# Altium schematic sheet HEADERS.SchDoc
size B; Organization: Altium Limited; Address1: L3, 12a Rodborough Rd; Address2: Frenchs Forest; Address3: NSW; Address4: Australia 2086
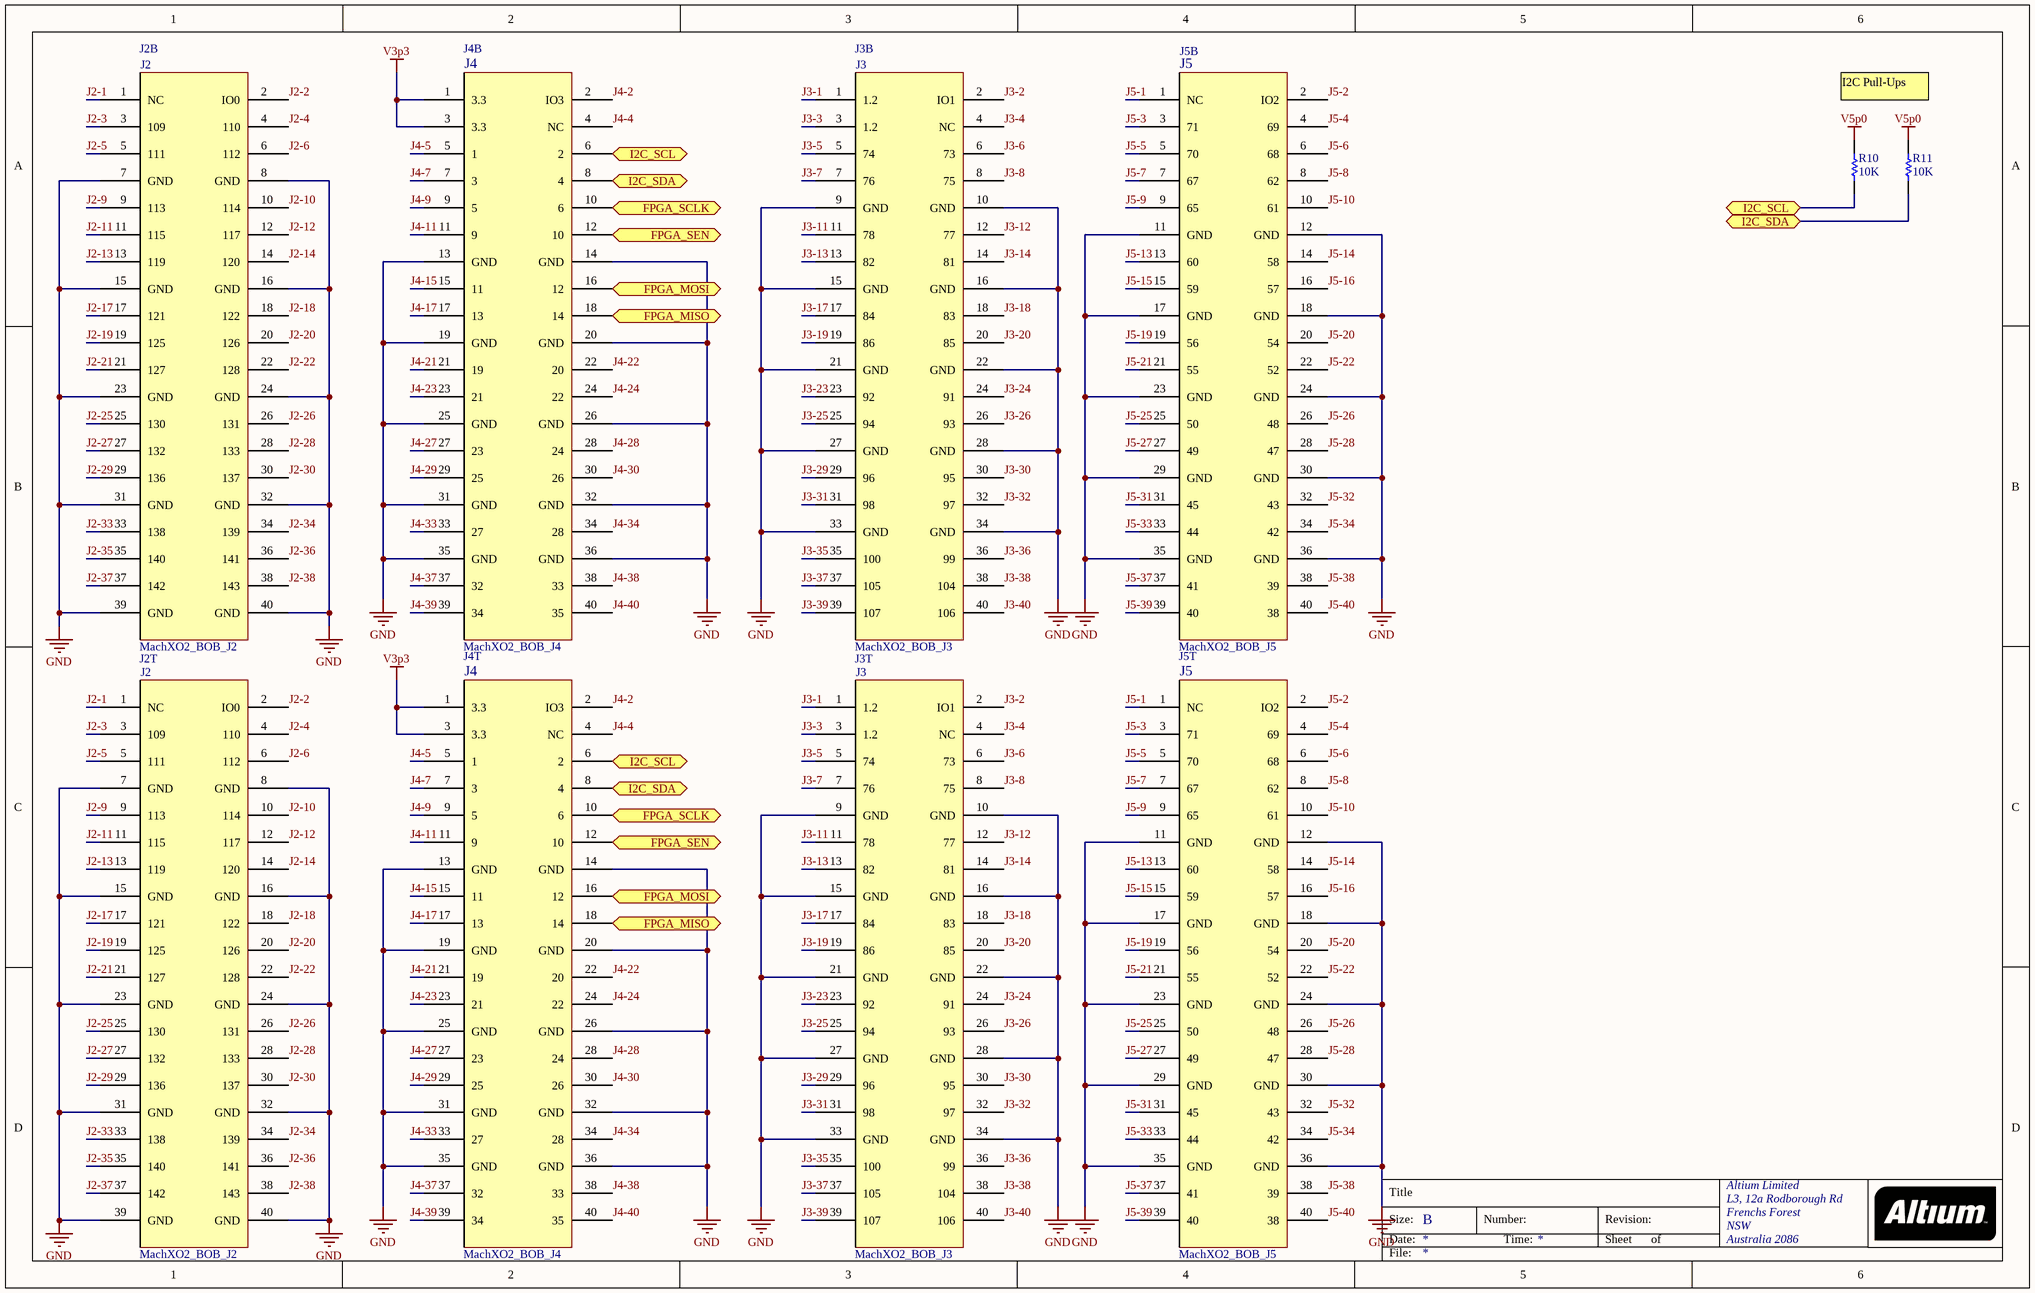
[diagram p0: HEADERS.SchDoc]

## Parts
J2B  MachXO2_BOB_J2  [RECEPTACLE_25.4MM_20x2_P1URC_SMT - duplicate]
J2T  MachXO2_BOB_J2  [HEADER_25.4MM_20x2_SMT_TOP]
J3B  MachXO2_BOB_J3  [RECEPTACLE_25.4MM_20x2_P1URC_SMT - duplicate]
J3T  MachXO2_BOB_J3  [HEADER_25.4MM_20x2_SMT_TOP]
J4B  MachXO2_BOB_J4  [RECEPTACLE_25.4MM_20x2_P1URC_SMT - duplicate]
J4T  MachXO2_BOB_J4  [HEADER_25.4MM_20x2_SMT_TOP]
J5B  MachXO2_BOB_J5  [RECEPTACLE_25.4MM_20x2_P1URC_SMT - duplicate]
J5T  MachXO2_BOB_J5  [HEADER_25.4MM_20x2_SMT_TOP]
R10  10K  [RES, 0603]
R11  10K  [RES, 0603]

## Ports
FPGA_MISO (bidir), FPGA_MOSI, FPGA_SCLK (bidir), FPGA_SEN (bidir), I2C_SCL (bidir), I2C_SDA (bidir)

## Nets
GND: J2B.7(GND) J2B.8(GND) J2B.15(GND) J2B.16(GND) J2B.23(GND) J2B.24(GND) J2B.31(GND) J2B.32(GND) J2B.39(GND) J2B.40(GND) J2T.7(GND) J2T.8(GND) J2T.15(GND) J2T.16(GND) J2T.23(GND) J2T.24(GND) J2T.31(GND) J2T.32(GND) J2T.39(GND) J2T.40(GND) J3B.9(GND) J3B.10(GND) J3B.15(GND) J3B.16(GND) J3B.21(GND) J3B.22(GND) J3B.27(GND) J3B.28(GND) J3B.33(GND) J3B.34(GND) J3T.9(GND) J3T.10(GND) J3T.15(GND) J3T.16(GND) J3T.21(GND) J3T.22(GND) J3T.27(GND) J3T.28(GND) J3T.33(GND) J3T.34(GND) J4B.13(GND) J4B.14(GND) J4B.19(GND) J4B.20(GND) J4B.25(GND) J4B.26(GND) J4B.31(GND) J4B.32(GND) J4B.35(GND) J4B.36(GND) J4T.13(GND) J4T.14(GND) J4T.19(GND) J4T.20(GND) J4T.25(GND) J4T.26(GND) J4T.31(GND) J4T.32(GND) J4T.35(GND) J4T.36(GND) J5B.11(GND) J5B.12(GND) J5B.17(GND) J5B.18(GND) J5B.23(GND) J5B.24(GND) J5B.29(GND) J5B.30(GND) J5B.35(GND) J5B.36(GND) J5T.11(GND) J5T.12(GND) J5T.17(GND) J5T.18(GND) J5T.23(GND) J5T.24(GND) J5T.29(GND) J5T.30(GND) J5T.35(GND) J5T.36(GND)
V3p3: J4B.1(3.3) J4B.3(3.3) J4T.1(3.3) J4T.3(3.3)
V5p0: R10.1 R11.1
FPGA_MISO: J4B.18(14) J4T.18(14) ; port FPGA_MISO
FPGA_MOSI: J4B.16(12) J4T.16(12) ; port FPGA_MOSI
FPGA_SCLK: J4B.10(6) J4T.10(6) ; port FPGA_SCLK
FPGA_SEN: J4B.12(10) J4T.12(10) ; port FPGA_SEN
I2C_SCL: J4B.6(2) J4T.6(2) R10.2 ; port I2C_SCL
I2C_SDA: J4B.8(4) J4T.8(4) R11.2 ; port I2C_SDA
J2-1: J2B.1(NC) J2T.1(NC)
J2-2: J2B.2(IO0) J2T.2(IO0)
J2-3: J2B.3(109) J2T.3(109)
J2-4: J2B.4(110) J2T.4(110)
J2-5: J2B.5(111) J2T.5(111)
J2-6: J2B.6(112) J2T.6(112)
J2-9: J2B.9(113) J2T.9(113)
J2-10: J2B.10(114) J2T.10(114)
J2-11: J2B.11(115) J2T.11(115)
J2-12: J2B.12(117) J2T.12(117)
J2-13: J2B.13(119) J2T.13(119)
J2-14: J2B.14(120) J2T.14(120)
J2-17: J2B.17(121) J2T.17(121)
J2-18: J2B.18(122) J2T.18(122)
J2-19: J2B.19(125) J2T.19(125)
J2-20: J2B.20(126) J2T.20(126)
J2-21: J2B.21(127) J2T.21(127)
J2-22: J2B.22(128) J2T.22(128)
J2-25: J2B.25(130) J2T.25(130)
J2-26: J2B.26(131) J2T.26(131)
J2-27: J2B.27(132) J2T.27(132)
J2-28: J2B.28(133) J2T.28(133)
J2-29: J2B.29(136) J2T.29(136)
J2-30: J2B.30(137) J2T.30(137)
J2-33: J2B.33(138) J2T.33(138)
J2-34: J2B.34(139) J2T.34(139)
J2-35: J2B.35(140) J2T.35(140)
J2-36: J2B.36(141) J2T.36(141)
J2-37: J2B.37(142) J2T.37(142)
J2-38: J2B.38(143) J2T.38(143)
J3-1: J3B.1(1.2) J3T.1(1.2)
J3-2: J3B.2(IO1) J3T.2(IO1)
J3-3: J3B.3(1.2) J3T.3(1.2)
J3-4: J3B.4(NC) J3T.4(NC)
J3-5: J3B.5(74) J3T.5(74)
J3-6: J3B.6(73) J3T.6(73)
J3-7: J3B.7(76) J3T.7(76)
J3-8: J3B.8(75) J3T.8(75)
J3-11: J3B.11(78) J3T.11(78)
J3-12: J3B.12(77) J3T.12(77)
J3-13: J3B.13(82) J3T.13(82)
J3-14: J3B.14(81) J3T.14(81)
J3-17: J3B.17(84) J3T.17(84)
J3-18: J3B.18(83) J3T.18(83)
J3-19: J3B.19(86) J3T.19(86)
J3-20: J3B.20(85) J3T.20(85)
J3-23: J3B.23(92) J3T.23(92)
J3-24: J3B.24(91) J3T.24(91)
J3-25: J3B.25(94) J3T.25(94)
J3-26: J3B.26(93) J3T.26(93)
J3-29: J3B.29(96) J3T.29(96)
J3-30: J3B.30(95) J3T.30(95)
J3-31: J3B.31(98) J3T.31(98)
J3-32: J3B.32(97) J3T.32(97)
J3-35: J3B.35(100) J3T.35(100)
J3-36: J3B.36(99) J3T.36(99)
J3-37: J3B.37(105) J3T.37(105)
J3-38: J3B.38(104) J3T.38(104)
J3-39: J3B.39(107) J3T.39(107)
J3-40: J3B.40(106) J3T.40(106)
J4-2: J4B.2(IO3) J4T.2(IO3)
J4-4: J4B.4(NC) J4T.4(NC)
J4-5: J4B.5(1) J4T.5(1)
J4-7: J4B.7(3) J4T.7(3)
J4-9: J4B.9(5) J4T.9(5)
J4-11: J4B.11(9) J4T.11(9)
J4-15: J4B.15(11) J4T.15(11)
J4-17: J4B.17(13) J4T.17(13)
J4-21: J4B.21(19) J4T.21(19)
J4-22: J4B.22(20) J4T.22(20)
J4-23: J4B.23(21) J4T.23(21)
J4-24: J4B.24(22) J4T.24(22)
J4-27: J4B.27(23) J4T.27(23)
J4-28: J4B.28(24) J4T.28(24)
J4-29: J4B.29(25) J4T.29(25)
J4-30: J4B.30(26) J4T.30(26)
J4-33: J4B.33(27) J4T.33(27)
J4-34: J4B.34(28) J4T.34(28)
J4-37: J4B.37(32) J4T.37(32)
J4-38: J4B.38(33) J4T.38(33)
J4-39: J4B.39(34) J4T.39(34)
J4-40: J4B.40(35) J4T.40(35)
J5-1: J5B.1(NC) J5T.1(NC)
J5-2: J5B.2(IO2) J5T.2(IO2)
J5-3: J5B.3(71) J5T.3(71)
J5-4: J5B.4(69) J5T.4(69)
J5-5: J5B.5(70) J5T.5(70)
J5-6: J5B.6(68) J5T.6(68)
J5-7: J5B.7(67) J5T.7(67)
J5-8: J5B.8(62) J5T.8(62)
J5-9: J5B.9(65) J5T.9(65)
J5-10: J5B.10(61) J5T.10(61)
J5-13: J5B.13(60) J5T.13(60)
J5-14: J5B.14(58) J5T.14(58)
J5-15: J5B.15(59) J5T.15(59)
J5-16: J5B.16(57) J5T.16(57)
J5-19: J5B.19(56) J5T.19(56)
J5-20: J5B.20(54) J5T.20(54)
J5-21: J5B.21(55) J5T.21(55)
J5-22: J5B.22(52) J5T.22(52)
J5-25: J5B.25(50) J5T.25(50)
J5-26: J5B.26(48) J5T.26(48)
J5-27: J5B.27(49) J5T.27(49)
J5-28: J5B.28(47) J5T.28(47)
J5-31: J5B.31(45) J5T.31(45)
J5-32: J5B.32(43) J5T.32(43)
J5-33: J5B.33(44) J5T.33(44)
J5-34: J5B.34(42) J5T.34(42)
J5-37: J5B.37(41) J5T.37(41)
J5-38: J5B.38(39) J5T.38(39)
J5-39: J5B.39(40) J5T.39(40)
J5-40: J5B.40(38) J5T.40(38)

## Notes on the sheet
- I2C Pull-Ups
- Title
- Size:
- Date:
- B
- Number:
- Time:
- Revision:
- Sheet
- of
- File:
- (in symbol MachXO2_BOB_J2) J2
- (in symbol MachXO2_BOB_J3) J3
- (in symbol MachXO2_BOB_J4) J4
- (in symbol MachXO2_BOB_J5) J5

## Library data of the parts
J2B J2T = MachXO2_BOB_J2: Manufacturer: 3M; Manufacturer Part Number: 966240-2000-AR-PR; Connector Type: Receptacle, Pass Through; Number of Positions: 40; Number of Positions Loaded: All; Pitch: 0.100" (2.54mm); Description: CONN SOCKET LO-PRO 40PS GOLD SMD; Packaging: Cut Tape (CT); Contact Type: Female Socket; Number of Rows: 2; Row Spacing: 0.100" (2.54mm); Mounting Type: Surface Mount; Termination: Solder; Fastening Type: -; Features: -; Contact Finish: Gold; Contact Finish Thickness: Flash; Color: Black; ComponentLink1URL: http://multimedia.3m.com/mws/mediawebserver?66666UuZjcFSLXTtNxTElXftEVuQEcuZgVs6EVs6E666666--; ComponentLink1Description: http://multimedia.3m.com/mws/mediawebserver?66666UuZjcFSLXTtNxTElXftEVuQEcuZgVs6EVs6E666666--; Supplier 1: Digi-Key; Supplier Part Number 1: 3M9579CT-ND; RoHS: RoHS Compliant; Category: Connectors, Interconnects; Stock 1: 767; Pricing 1: 1=6.97, 10=6.679, 25=6.0984, 50=5.808, 100=5.5176, 250=4.9368 (USD); Supplier 2: Digi-Key; Supplier Part Number 2: TSM-120-01-L-DV-P-ND
J3B J3T = MachXO2_BOB_J3: Manufacturer: 3M; Manufacturer Part Number: 966240-2000-AR-PR; Connector Type: Receptacle, Pass Through; Number of Positions: 40; Number of Positions Loaded: All; Pitch: 0.100" (2.54mm); Description: CONN SOCKET LO-PRO 40PS GOLD SMD; Packaging: Cut Tape (CT); Contact Type: Female Socket; Number of Rows: 2; Row Spacing: 0.100" (2.54mm); Mounting Type: Surface Mount; Termination: Solder; Fastening Type: -; Features: -; Contact Finish: Gold; Contact Finish Thickness: Flash; Color: Black; ComponentLink1URL: http://multimedia.3m.com/mws/mediawebserver?66666UuZjcFSLXTtNxTElXftEVuQEcuZgVs6EVs6E666666--; ComponentLink1Description: http://multimedia.3m.com/mws/mediawebserver?66666UuZjcFSLXTtNxTElXftEVuQEcuZgVs6EVs6E666666--; Supplier 1: Digi-Key; Supplier Part Number 1: 3M9579CT-ND; RoHS: RoHS Compliant; Category: Connectors, Interconnects; Stock 1: 767; Pricing 1: 1=6.97, 10=6.679, 25=6.0984, 50=5.808, 100=5.5176, 250=4.9368 (USD)
J4B J4T = MachXO2_BOB_J4: Manufacturer: 3M; Manufacturer Part Number: 966240-2000-AR-PR; Connector Type: Receptacle, Pass Through; Number of Positions: 40; Number of Positions Loaded: All; Pitch: 0.100" (2.54mm); Description: CONN SOCKET LO-PRO 40PS GOLD SMD; Packaging: Cut Tape (CT); Contact Type: Female Socket; Number of Rows: 2; Row Spacing: 0.100" (2.54mm); Mounting Type: Surface Mount; Termination: Solder; Fastening Type: -; Features: -; Contact Finish: Gold; Contact Finish Thickness: Flash; Color: Black; ComponentLink1URL: http://multimedia.3m.com/mws/mediawebserver?66666UuZjcFSLXTtNxTElXftEVuQEcuZgVs6EVs6E666666--; ComponentLink1Description: http://multimedia.3m.com/mws/mediawebserver?66666UuZjcFSLXTtNxTElXftEVuQEcuZgVs6EVs6E666666--; Supplier 1: Digi-Key; Supplier Part Number 1: 3M9579CT-ND; RoHS: RoHS Compliant; Category: Connectors, Interconnects; Stock 1: 767; Pricing 1: 1=6.97, 10=6.679, 25=6.0984, 50=5.808, 100=5.5176, 250=4.9368 (USD)
J5B J5T = MachXO2_BOB_J5: Manufacturer: 3M; Manufacturer Part Number: 966240-2000-AR-PR; Connector Type: Receptacle, Pass Through; Number of Positions: 40; Number of Positions Loaded: All; Pitch: 0.100" (2.54mm); Description: CONN SOCKET LO-PRO 40PS GOLD SMD; Packaging: Cut Tape (CT); Contact Type: Female Socket; Number of Rows: 2; Row Spacing: 0.100" (2.54mm); Mounting Type: Surface Mount; Termination: Solder; Fastening Type: -; Features: -; Contact Finish: Gold; Contact Finish Thickness: Flash; Color: Black; ComponentLink1URL: http://multimedia.3m.com/mws/mediawebserver?66666UuZjcFSLXTtNxTElXftEVuQEcuZgVs6EVs6E666666--; ComponentLink1Description: http://multimedia.3m.com/mws/mediawebserver?66666UuZjcFSLXTtNxTElXftEVuQEcuZgVs6EVs6E666666--; Supplier 1: Digi-Key; Supplier Part Number 1: 3M9579CT-ND; RoHS: RoHS Compliant; Category: Connectors, Interconnects; Stock 1: 767; Pricing 1: 1=6.97, 10=6.679, 25=6.0984, 50=5.808, 100=5.5176, 250=4.9368 (USD)
R10 R11 = RES_0603_10K: Resistor, 0603, 1/10W, 10K ohm; Manufacturer: Panasonic Electronic Components; Manufacturer Part Number: ERJ-3EKF1002V; Description: RES 10K OHM 1/10W 1% 0603 SMD; Tolerance: ±1%; Power (Watts): 0.1W, 1/10W; Temperature Coefficient: ±100ppm/°C; Supplier 1: Digi-Key; RoHS: RoHS Compliant; Category: Resistors; Stock 1: 4631019; Pricing 1: 1=0.1, 50=0.0138, 100=0.0105, 250=0.0078, 500=0.00576, 1000=0.00384 (USD); Packaging: Cut Tape (CT); Resistance (Ohms): 10k; Composition: Thick Film; Features: -; Package / Case: 0603 (1608 Metric); Supplier Device Package: 0603; Size / Dimension: 0.063" L x 0.031" W (1.60mm x 0.80mm); Height: 0.022" (0.55mm); Number of Terminations: 2; ComponentLink1URL: http://industrial.panasonic.com/www-cgi/jvcr13pz.cgi?E+PZ+3+AOA0002+ERJ3EKF1002V+7+WW; ComponentLink1Description: http://industrial.panasonic.com/www-cgi/jvcr13pz.cgi?E+PZ+3+AOA0002+ERJ3EKF1002V+7+WW; Supplier Part Number 1: P10.0KHCT-ND